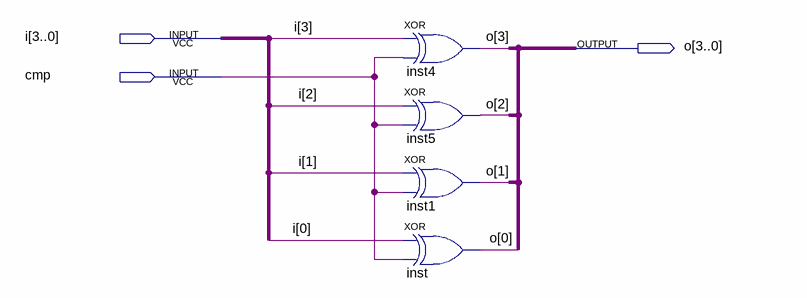
[diagram p0: schematic sheet]
// Quartus schematic complementa.bdf as structural Verilog: 4 symbols, 3 pins
module complementa (
  input  [3:0] i,
  input  cmp,
  output [3:0] o
);

  xor inst4 (o[3], i[3], cmp);
  xor inst5 (o[2], i[2], cmp);
  xor inst1 (o[1], i[1], cmp);
  xor inst (o[0], i[0], cmp);
endmodule
